# EAGLE design ESP_PGMR (EAGLE 9.4.1)
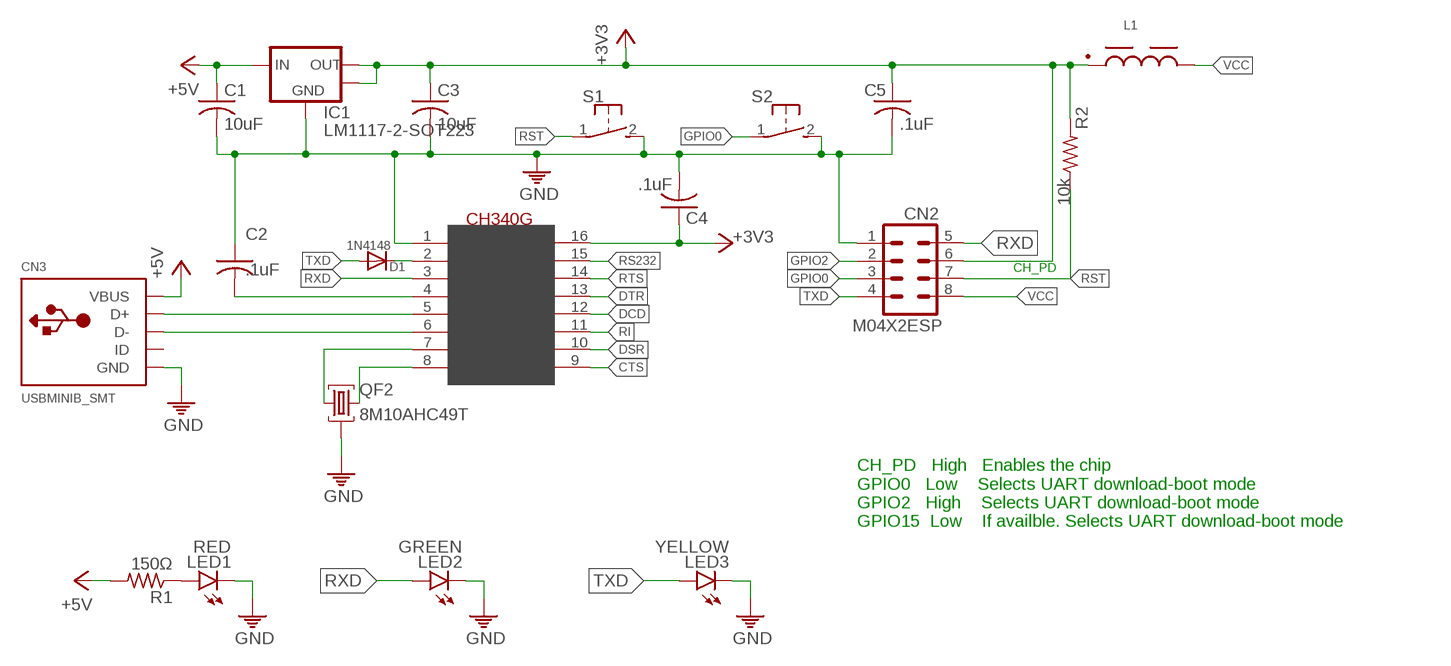
[diagram p0: schematic, sheet 1]

## Parts
C1  10uF  C-USC0805  [C0805]
C2  .1uF  C-USC0805  [C0805]
C3  10uF  C-USC0805  [C0805]
C4  .1uF  C-USC0805  [C0805]
C5  .1uF  C-USC0805  [C0805]
CN2  M04X2ESP  [2X04-ESP]
CN3  USBMINIB_SMT  [USB_MINI_B]
D1  1N4148  DIODE_SOD-123  [SOD-123]
IC1  LM1117-2-SOT223  [SOT-223-3]
IC2  CH340G  [SOIC16]
L1  WE-CBA_0805_782851102_WB/HS  [WE-CBA_0805(W=3)]
LED1  RED  LEDCHIPLED_1206  [CHIPLED_1206]
LED2  GREEN  LEDCHIPLED_1206  [CHIPLED_1206]
LED3  YELLOW  LEDCHIPLED_1206  [CHIPLED_1206]
QF2  8M10AHC49T  [HC49U]
R1  150Ω  R-US_M0805  [M0805]
R2  10k  R-US_R0805  [R0805]
S1  MOMENTARY-SWITCH-SPST-PTH-6.0X6.0-5MM  [TACTILE_SWITCH_PTH_6.0X6.0-5MM]
S2  MOMENTARY-SWITCH-SPST-PTH-6.0X6.0-5MM  [TACTILE_SWITCH_PTH_6.0X6.0-5MM]

## Nets
+3V3: C3.1 C4.1 C5.1 CN2.6 IC1.2(VOUT) IC1.4(HEATSINK) IC2.16(VCC) L1.1 R2.2
+5V: C1.1 CN3.VBUS IC1.3(VIN) R1.2
CTS: IC2.9(CTS)
D+: CN3.D+ IC2.5(D+)
D-: CN3.D- IC2.6(D-)
DCD: IC2.12(DCD)
DSR: IC2.10(DSR)
DTR: IC2.13(DTR)
GND: C1.2 C2.1 C3.2 C4.2 C5.2 CN2.1 CN3.GND CN3.GND1(GND) CN3.GND2(GND) CN3.GND3(GND) CN3.GND4(GND) IC1.1(GND) IC2.1(GND) LED1.C LED2.C LED3.C QF2.2 S1.2(S) S2.2(S)
GPIO0: CN2.3 S2.1(P)
GPIO2: CN2.2
N$1: IC2.7(XI) QF2.1
N$2: IC2.8(XO) QF2.3
N$3: LED1.A R1.1
N$8: C2.2 IC2.4(V3)
RI: IC2.11(RI)
RS232: IC2.15(RS232)
RST: CN2.7 R2.1 S1.1(P)
RTS: IC2.14(RTS)
RXD: CN2.5 IC2.3(RX) LED2.A
TX: D1.C IC2.2(TX)
TXD: CN2.4 D1.A LED3.A
VCC: CN2.8 L1.2
Unconnected: CN3.ID

## Notes on the sheet
- CH_PD
- CH_PD   High   Enables the chip
  GPIO0   Low    Selects UART download-boot mode
  GPIO2   High    Selects UART download-boot mode
  GPIO15  Low    If availble. Selects UART download-boot mode

## Library data of the parts
C1-C5 = rcl:C-US: CAPACITOR, American symbol; SPICEPREFIX: C
CN2 = headers:M04X2ESP
CN3 = usb-serial:USB
D1 = diode:DIODE_: Diode SMADIODE - SMA Surface Mount Package 20V 1A Schottky Diode Digikey: 641-1014-6-ND DO-1N4148 - Through Hole Small Current Diode SOD-123 20V 1 A (.5mV Vf) Schottky Diode - Digikey: MBRX120TPMSCT-ND SOD-323 10V 570mA (.38mV Vf, 3ns) Schottky Diode - Digikey: ZLLS410CT-ND SOD-523 30V 30mA Schottky Diode (RB751S-40TE61) - Digikey: RB751S-40TE61CT-ND SOT23-R/W - SOT23 Package (R = Solder Paste/Reflow Ovens, W = Hand-Soldering) BAT54Film 40V 300mA - Digikey: 497-7162-1-ND Description Diode Switching 150mA 100V 400mW SOD123 Diodes Inc 1N4148W-7-F Switching Diode 100V, 2-Pin SOD-123 Source: Datasheet Technologies Attributes DESCRIPTION HEIGHT MANUFACTURER_NAME MANUFACTURER_PART_NUMBER MOUSER_PART_NUMBER 1N4148W-7-F Diode Switching 150mA 100V 400mW SOD123 Diodes Inc 1N4148W-7-F Switching Diode 100V, 2-Pin SOD-123 1.15mm Diodes Inc. 1N4148W-7-F 621-1N4148W-F
IC1 = regulators:LM1117-2: LDO Voltage Regulator NCP1117 series are low dropout positive voltage regulators that are capable of providing an output current that is in excess of 1.0 A with a maximum dropout voltage of 1.2 V at 800 mA over temperature. This series contains nine fixed output voltages of 1.5 V, 1.8 V, 1.9 V, 2.0 V, 2.5 V, 2.85 V, 3.3 V, 5.0 V, and 12 V that have no minimum load requirement to maintain regulation. Also included is an adjustable output version that can be programmed from 1.25 V to 18.8 V with two external resistors. datasheet.pdf <http://www.onsemi.com/pub_link/Collateral/NCP1117-D.PDF> LM1117-N is a series of low dropout voltage regulators of 1.2V at 800mA of load current. It has the same pin-out as Texas Instruments' industry standard LM317. The LM1117-N is available in an adjustable version, available in five fixed voltages, 1.8V, 2.5V, 2.85V, 3.3V, and 5V. The LM1117-N offers current limiting and thermal shutdown. Its circuit includes a zener trimmed to within ±1%. datasheet.pdf <http://www.ti.com/lit/ds/symlink/lm1117-n.pdf>
IC2 = usb-serial:CH340G
L1 = Wurth_Elektronik_Passive_rev19b:WE-CBA_0805: WE-CBA SMD EMI Suppression Ferrite Bead Characteristics Reliable Ni-Sn electrodes High rated current up to 5A Recommended soldering: Reflow Operating temperature: -55°C to +125°C Applications * Perfect as data line filter and for uncoupling of distribution voltage *This special SMD chip bead ferrites can be put directly on the printed circuit board. They offer excellent anti-EMI properties and low DC-resistance. Placed very close next to the interference source even with smallest size 0402,maximal impedance at 1000 Ω can be reached. *High Speed: "High Speed " SMD ferrites WE-CBF have lower impedance in the lower frequency ranges thus they have only a low attenuation for fast signals. Application e.g. USB 2.0, IEEE 1394,LVDS *Wide Band: "Wide Band" SMD ferrites WE-CBF already show high impedance in low frequency range. Therefore they are wide band through the whole spectrum. Application e.g. control signats, RS232, RS422, DC/DC converter *High Current: "High Current " SMD ferrites WE-CBF are designed for high current (over 1 A). The rated current refers to 40K self-heating. High current SMD ferrites are available in all there types (High Speed, Wide Band and High Frequency). Application e.g. power supply, DC/DC converter *Advice: Pay attention for the use of SMD-Ferrites for high current>1A and ambient temperature over +85°C that the rated current has to be reduced when temperature is above +85°C (Derating). *At+100°C environment temperature the maximal rated current has to add up to only 60% of the data sheet value ,without an overload of the component. Variant abbreviation WB means WIDE BAND HS means HIGH SPEED HC means HIGH CURRENT <http://katalog.we-online.de/media/images/v2/Family_WE-CBA.jpg> Details see: http://katalog.we-online.de/en/pbs/WE-CBA/ Created: 2015-02-02 2015 (C) Wurth Elektronik
LED1-LED3 = led:LED: LED OSRAM: - CHIPLED LG R971, LG N971, LY N971, LG Q971, LY Q971, LO R971, LY R971 LH N974, LH R974 LS Q976, LO Q976, LY Q976 LO Q996 - Hyper CHIPLED LW Q18S LB Q993, LB Q99A, LB R99A - SideLED LS A670, LO A670, LY A670, LG A670, LP A670 LB A673, LV A673, LT A673, LW A673 LH A674 LY A675 LS A676, LA A676, LO A676, LY A676, LW A676 LS A679, LY A679, LG A679 - Hyper Micro SIDELED® LS Y876, LA Y876, LO Y876, LY Y876 LT Y87S - SmartLED LW L88C, LW L88S LB L89C, LB L89S, LG L890 LS L89K, LO L89K, LY L89K LS L896, LA L896, LO L896, LY L896 - TOPLED LS T670, LO T670, LY T670, LG T670, LP T670 LSG T670, LSP T670, LSY T670, LOP T670, LYG T670 LG T671, LOG T671, LSG T671 LB T673, LV T673, LT T673, LW T673 LH T674 LS T676, LA T676, LO T676, LY T676, LB T676, LH T676, LSB T676, LW T676 LB T67C, LV T67C, LT T67C, LS T67K, LO T67K, LY T67K, LW E67C LS E67B, LA E67B, LO E67B, LY E67B, LB E67C, LV E67C, LT E67C LW T67C LS T679, LY T679, LG T679 LS T770, LO T770, LY T770, LG T770, LP T770 LB T773, LV T773, LT T773, LW T773 LH T774 LS E675, LA E675, LY E675, LS T675 LS T776, LA T776, LO T776, LY T776, LB T776 LHGB T686 LT T68C, LB T68C - Hyper Mini TOPLED® LB M676 - Mini TOPLED Santana® LG M470 LS M47K, LO M47K, LY M47K Source: http://www.osram.convergy.de LUXEON: - LUMILED® LXK2-PW12-R00, LXK2-PW12-S00, LXK2-PW14-U00, LXK2-PW14-V00 LXK2-PM12-R00, LXK2-PM12-S00, LXK2-PM14-U00 LXK2-PE12-Q00, LXK2-PE12-R00, LXK2-PE12-S00, LXK2-PE14-T00, LXK2-PE14-U00 LXK2-PB12-K00, LXK2-PB12-L00, LXK2-PB12-M00, LXK2-PB14-N00, LXK2-PB14-P00, LXK2-PB14-Q00 LXK2-PR12-L00, LXK2-PR12-M00, LXK2-PR14-Q00, LXK2-PR14-R00 LXK2-PD12-Q00, LXK2-PD12-R00, LXK2-PD12-S00 LXK2-PH12-R00, LXK2-PH12-S00 LXK2-PL12-P00, LXK2-PL12-Q00, LXK2-PL12-R00 Source: www.luxeon.com KINGBRIGHT: KA-3528ASYC Source: www.kingbright.com
QF2 = crystal:8M10AHC49T: Monolithic Crystal Filters Source: www.vanlong.com; OC_FARNELL: unknown; OC_NEWARK: unknown
R1 = resistor:R-US_: RESISTOR, American symbol
R2 = rcl:R-US_: RESISTOR, American symbol; SPICEPREFIX: R
S1 S2 = switch:MOMENTARY-SWITCH-SPST: Momentary Switch (Pushbutton) - SPST Normally-open (NO) SPST momentary switches (buttons, pushbuttons). Variants PTH-12MM - 12mm square, through-hole Momentary Pushbutton Switch - 12mm Square <https://www.sparkfun.com/products/9190> (COM-09190) PTH-6.0MM, PTH-6.0MM-KIT - 6.0mm square, through-hole Mini Pushbutton Switch <https://www.sparkfun.com/products/97> (COM-00097) KIT package intended for soldering kit's - only one side of pads' copper is exposed. PTH-RIGHT-ANGLE-KIT - Right-angle, through-hole Right Angle Tactile Button <https://www.sparkfun.com/products/10791> - Used on SparkFun BigTime Watch Kit <https://www.sparkfun.com/products/11734> SMD-12MM - 12mm square, surface-mount Tactile Button - SMD (12mm) <https://www.sparkfun.com/products/12993> (COM-12993) Used on SparkFun PicoBoard <https://www.sparkfun.com/products/11888> SMD-4.5MM - 4.5mm Square Trackball Switch Used on SparkFun Blackberry Trackballer Breakout <https://www.sparkfun.com/products/13169> SMD-4.6MMX2.8MM - 4.60mm x 2.80mm, surface mount Used on SparkFun SAMD21 Mini Breakout <https://www.sparkfun.com/products/13664> SMD-5.2MM, SMD-5.2-REDUNDANT - 5.2mm square, surface-mount Mini Pushbutton Switch - SMD <https://www.sparkfun.com/products/8720> (COM-08720) Used on Arduino Pro Mini <https://www.sparkfun.com/products/11114> REDUNDANT package connects both switch circuits together SMD-6.0X3.5MM - 6.0 x 3.5mm, surface mount Momentary Reset Switch SMD <https://www.sparkfun.com/products/8229> (COM-08229) SMD-6.2MM-TALL - 6.2mm square, surface mount Tactile Button - SMD (6mm) <https://www.sparkfun.com/products/12992> Used on SparkFun Digital Sandbox <https://www.sparkfun.com/products/12651> SMD-RIGHT-ANGLE - Right-angle, surface mount Used on SparkFun Block for Intel® Edison - Arduino <https://www.sparkfun.com/products/13036>

## Net classes
1 vcc: width 0.305 mm

## Board
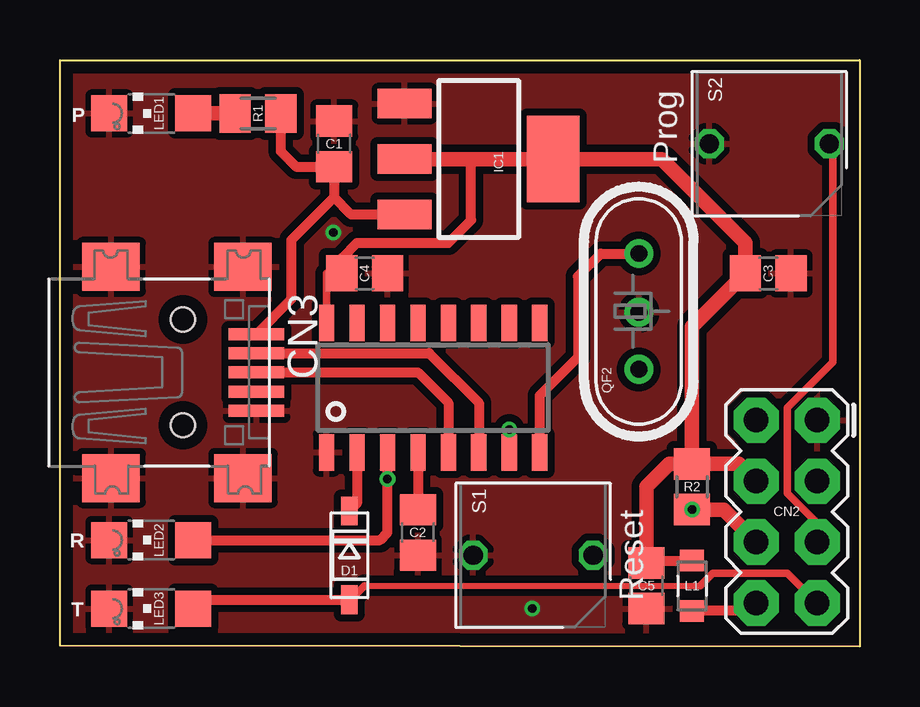
[diagram p1: board, top side]
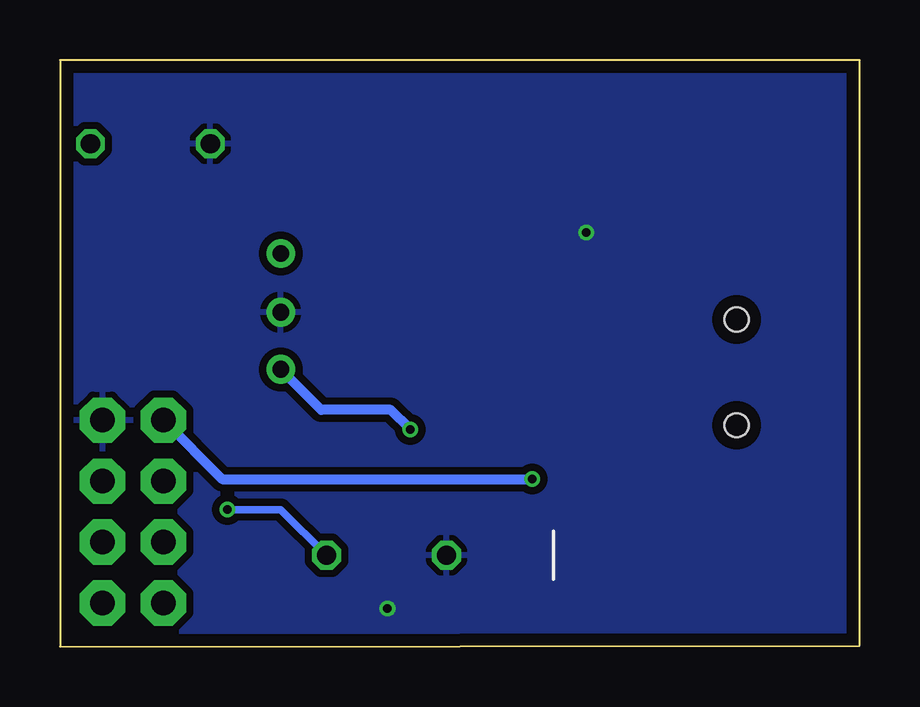
[diagram p2: board, bottom side, seen from below]

Size 33.34 x 24.45 mm. Coordinates in mm from the lower left corner, seen from the top.
Outline: 0,0.05 0,24.45 33.34,24.45 33.34,0 0,0.05
Copper layers (1*16): Top 0.035mm / dielectric 1.6mm / Bottom 0.035mm
Design rules "Elecrow_2-layer_PCB_eagle_rule": minimum track width 6mil, minimum drill 12mil, track to track 6mil, track to pad 6mil, pad to pad 6mil, via to via 8mil, smd to smd 0mil, copper to edge 20mil, drill to drill 10mil, minimum pad ring 6mil, minimum via ring 6mil, stop-mask expansion 0mil, vias tented up to drill 100mil, thermal gap 10mil

### Footprints (pad centres in the part's own frame; a part is rotated, then mirrored left to right if it is on the bottom)
C0805 = smd 1.3 x 1.5: 1 -0.95,0; 2 0.95,0
2X04-ESP = drill 1.016 pad 1.88 octagon: 1 -3.81,1.27; 2 -1.27,1.27; 3 1.27,1.27; 4 3.81,1.27; 5 -3.81,-1.27; 6 -1.27,-1.27; 7 1.27,-1.27; 8 3.81,-1.27
USB_MINI_B = smd 0.5 x 2.308: D+ 0,4.064; D- -0.8,4.064; GND 1.6,4.064; ID 0.8,4.064; VBUS -1.6,4.064 | smd 2 x 2.4: GND1 -4.4,-2; GND2 -4.4,3.5; GND3 4.4,3.5; GND4 4.4,-2 | hole 1: -2.2,1; 2.2,1
SOD-123 = smd 1.2 x 0.7: A 1.85,0; C -1.85,0
SOT-223-3 = smd 1.219 x 2.235: 1 -2.311,-3.099; 2 0,-3.099; 3 2.311,-3.099 | smd 3.6 x 2.2: 4 0,3.099
SOIC16 = smd 0.635 x 1.524: 1 -4.445,-2.695; 2 -3.175,-2.695; 3 -1.905,-2.695; 4 -0.635,-2.695; 5 0.635,-2.695; 6 1.905,-2.695; 7 3.175,-2.695; 8 4.445,-2.695; 9 4.445,2.695; 10 3.175,2.695; 11 1.905,2.695; 12 0.635,2.695; 13 -0.635,2.695; 14 -1.905,2.695; 15 -3.175,2.695; 16 -4.445,2.695
WE-CBA_0805(W=3) = smd 0.9 x 1: 1 -1.05,0; 2 1.05,0
CHIPLED_1206 = smd 1.5 x 1.5: A 0,-1.75; C 0,1.75
HC49U = drill 0.7 pad 1.2: 1 -2.413,0; 2 -0.027,0; 3 2.413,0
M0805 = smd 1.3 x 1.6: 1 -0.95,0; 2 0.95,0
R0805 = smd 1.3 x 1.5: 1 -0.95,0; 2 0.95,0
TACTILE_SWITCH_PTH_6.0X6.0-5MM = drill 0.8 octagon: 1 0,0; 2 5,0

### Placement (x,y rotation side)
C1  11.43,20.95 90 top
C2  14.92,4.76 90 top
C3  29.53,15.56 0 top
C4  12.7,15.56 0 top
C5  24.45,2.54 270 top
CN2  30.3,5.63 270 top
CN3  4.13,11.43 270 top
D1  12.06,3.81 270 top
IC1  17.46,20.32 270 top
IC2  15.56,10.79 0 top
L1  26.35,2.54 270 top
LED1  3.81,22.23 90 top
LED2  3.81,4.45 90 top
LED3  3.81,1.59 90 top
QF2  24.13,13.97 90 top
R1  8.26,22.23 0 top
R2  26.35,6.67 90 top
S1  22.23,3.81 180 top
S2  32.07,20.95 180 top

### Tracks (layer width: path | path; a pad name or v marks a point on that pad's centre or on a via)
+3V3
  Top 0.305: IC2.16 11.11,15.56 C4.1
  Top 0.406: C4.1 11.75,16.19 12.38,16.83 16.19,16.83 17.14,17.78 17.14,20.32 | C5.1 24.55,3.59 L1.1
  Top 0.61: IC1.2 17.14,20.32 IC1.4 25.09,20.32 28.58,16.83 C3.1 26.35,13.33 R2.2 | R2.2 28.31,7.62 CN2.6 | R2.2 25.4,7.62 24.45,6.67 C5.1
+5V
  Top 0.406: IC1.3 12.14,18.01 11.43,18.72 | 11.43,18.72 9.65,16.95 9.65,14.49 CN3.VBUS | 11.43,18.72 C1.1 9.85,20 9.84,20 9.21,20.64 R1.2
D+
  Top 0.406: CN3.D+ 14.92,11.43 16.19,10.16 IC2.5
D-
  Top 0.406: CN3.D- 15.39,12.23 17.46,10.16 IC2.6
GND  (via drill 0.35)
  other vias: 19.68,1.59 11.4,17.26
  pour Bottom (isolate 0.305): 0,0 33.34,0 33.34,24.45 0,24.45
  pour Top (isolate 0.305): 0,0 33.34,0 33.34,24.45 0,24.45
GPIO0
  Top 0.305: S2.1 32.22,20.8 32.22,11.86 30.32,9.96 30.32,6.39 31.57,5.14 CN2.3
N$1  (via drill 0.35)
  Top 0.406: IC2.7 v18.73,9.05
  Bottom 0.406: v18.73,9.05 19.55,9.87 22.45,9.87 QF2.1
N$2
  Top 0.406: IC2.8 20,10.48 21.59,12.06 21.59,15.43 22.54,16.38 QF2.3
N$3
  Top 0.61: R1.1 LED1.A
N$8
  Top 0.406: IC2.4 C2.2
RST  (via drill 0.35)
  Top 0.61: R2.1 27.67,5.71 CN2.7
  Bottom 0.305: S1.1 24.13,5.72 R2.1
  other vias: 26.35,5.72
RXD  (via drill 0.35)
  Top 0.406: LED2.A 13.34,4.45 13.65,4.76 v13.65,6.99 IC2.3
  Bottom 0.406: CN2.5 26.57,6.99 v13.65,6.99
TX
  Top 0.406: IC2.2 12.38,5.98 D1.C
TXD
  Top 0.254: 12.69,2.55 26.69,2.55
  Top 0.305: 26.69,2.55 27.21,3.07 30.32,3.07 CN2.4 | 12.69,2.55 12.11,1.96 D1.A
  Top 0.406: LED3.A 5.93,1.96 D1.A
VCC
  Top 0.406: L1.2 26.37,1.5 28.71,1.5 CN2.8

### Text on the board
tPlace: P | Prog | R | Reset | T